# EAGLE schematic Control (EAGLE 7.5.0)
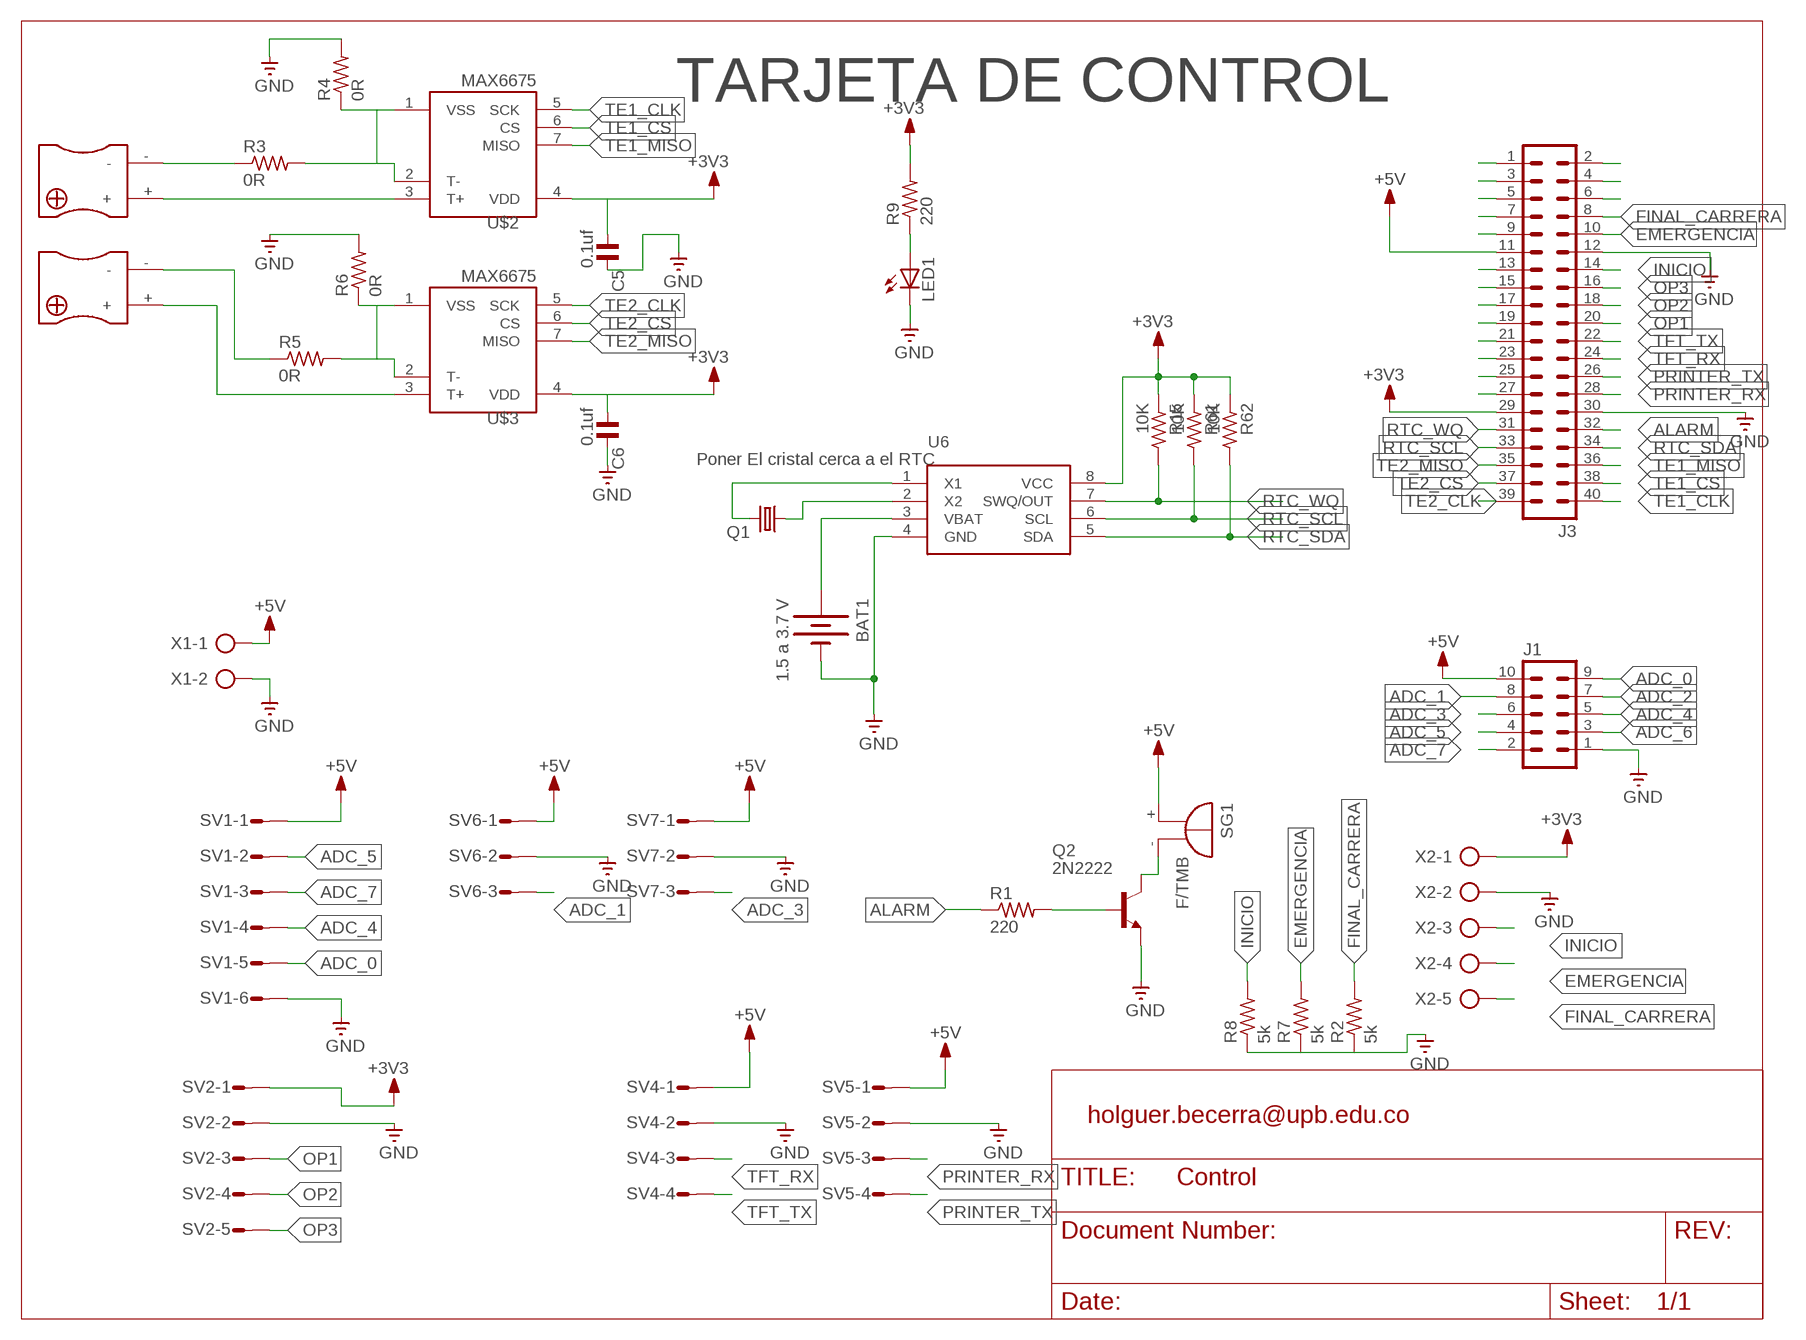
[diagram p0: schematic, sheet 1]

## Parts
BAT1  1.5 a 3.7 V  BATTERY20PTH  [BATTCOM_20MM_PTH]
C5  0.1uf  C2,5-3  [C2.5-3]
C6  0.1uf  C2,5-3  [C2.5-3]
J1  ML10  [ML10]
J3  ML40  [ML40]
LED1  LED  [SMARTLED-TTW]
Q1  CRYSTALTC26H  [TC26H]
Q2  2N2222  [TO18]
R1  220  R-US_0204/5  [0204/5]
R2  5k  R-US_0204/5  [0204/5]
R3  0R  R-US_0204/5  [0204/5]
R4  0R  R-US_0204/5  [0204/5]
R5  0R  R-US_0204/5  [0204/5]
R6  0R  R-US_0204/5  [0204/5]
R7  5k  R-US_0204/5  [0204/5]
R8  5k  R-US_0204/5  [0204/5]
R9  220  R-US_0204/5  [0204/5]
R15  10K  R-US_R0603  [R0603]
R61  10K  R-US_R0603  [R0603]
R62  10K  R-US_R0603  [R0603]
SG1  F/TMB  [F/TMB]
SV1  L06P  [L06P]
SV2  L05P  [L05P]
SV4  L04P  [L04P]
SV5  L04P  [L04P]
SV6  L03P  [L03P]
SV7  L03P  [L03P]
U6  DS1338  [SO08]
U$1  THERMOCOUPLEPLUG_MINI  [TC-MINI]
U$2  MAX6675  [SO08]
U$3  MAX6675  [SO08]
U$4  THERMOCOUPLEPLUG_MINI  [TC-MINI]
X1  AK500/2  [AK500/2]
X2  AK500/5-H  [AK500/5-H]

## Nets
5VCC: J1.10 J3.11 SG1.+ SV1.1 SV4.1 SV5.1 SV6.1 SV7.1 X1.1 ; supply symbol labelled +5V
+3V3: C5.1 C6.1 J3.29 R9.2 R15.1 R61.1 R62.1 SV2.1 U6.8(VCC) U$2.4(VDD) U$3.4(VDD) X2.1
ADC_0: J1.9 SV1.5
ADC_1: J1.8 SV6.3
ADC_2: J1.7
ADC_3: J1.6 SV7.3
ADC_4: J1.5 SV1.4
ADC_5: J1.4 SV1.2
ADC_6: J1.3
ADC_7: J1.2 SV1.3
ALARM: J3.32 R1.1
EMERGENCIA: J3.10 R7.2 X2.4
FINAL_CARRERA: J3.8 R2.2 X2.5
GND: BAT1.2(-) C5.2 C6.2 J1.1 J3.12 J3.30 LED1.C@1(C) Q2.1(E) R2.1 R4.2 R6.2 R7.1 R8.1 SV1.6 SV2.2 SV4.2 SV5.2 SV6.2 SV7.2 U6.4(GND) X1.2 X2.2
INICIO: J3.14 R8.2 X2.3
N$1: Q1.2 U6.1(X1)
N$2: LED1.A@1(A) R9.1
N$3: J3.9
N$4: Q2.3(C) SG1.-
N$5: Q2.2(B) R1.2
N$6: U$1.+ U$2.3(T+)
N$7: R5.1 U$4.-
N$8: U$3.3(T+) U$4.+
N$9: Q1.1 U6.2(X2)
N$11: R3.1 U$1.-
N$30: R5.2 R6.1 U$3.1(VSS) U$3.2(T-)
N$31: R3.2 R4.1 U$2.1(VSS) U$2.2(T-)
N$33: J3.2
N$34: J3.4
N$35: BAT1.1(+) U6.3(VBAT)
N$36: J3.6
N$60: J3.27
N$61: J3.25
N$62: J3.23
N$63: J3.21
N$64: J3.19
N$65: J3.17
N$66: J3.15
N$67: J3.13
N$70: J3.7
N$71: J3.5
N$72: J3.3
N$73: J3.1
OP1: J3.20 SV2.3
OP2: J3.18 SV2.4
OP3: J3.16 SV2.5
PRINTER_RX: J3.28 SV5.3
PRINTER_TX: J3.26 SV5.4
RTC_SCL: J3.33 R61.2 U6.6(SCL)
RTC_SDA: J3.34 R62.2 U6.5(SDA)
RTC_WQ: J3.31 R15.2 U6.7(SWQ/OUT)
TE1_CLK: J3.40 U$2.5(SCK)
TE1_CS: J3.38 U$2.6(CS)
TE1_MISO: J3.36 U$2.7(MISO)
TE2_CLK: J3.39 U$3.5(SCK)
TE2_CS: J3.37 U$3.6(CS)
TE2_MISO: J3.35 U$3.7(MISO)
TFT_RX: J3.24 SV4.3
TFT_TX: J3.22 SV4.4

## Notes on the sheet
- TARJETA DE CONTROL
- Poner El cristal cerca a el RTC
- holguer.becerra@upb.edu.co

## Library data of the parts
BAT1 = SparkFun:BATTERY: Battery Holders Various common sizes : AA, AAA, 20mm coin cell and 12mm coin cell.
C5 C6 = capacitor-wima:C: CAPACITOR naming: grid - package width
J1 = con-harting-ml:ML10: HARTING
J3 = con-harting-ml:ML40: HARTING
LED1 = adafruit:LED: LED OSRAM: - CHIPLED LG R971, LG N971, LY N971, LG Q971, LY Q971, LO R971, LY R971 LH N974, LH R974 LS Q976, LO Q976, LY Q976 LO Q996 - Hyper CHIPLED LW Q18S LB Q993, LB Q99A, LB R99A - SideLED LS A670, LO A670, LY A670, LG A670, LP A670 LB A673, LV A673, LT A673, LW A673 LH A674 LY A675 LS A676, LA A676, LO A676, LY A676, LW A676 LS A679, LY A679, LG A679 - Hyper Micro SIDELED® LS Y876, LA Y876, LO Y876, LY Y876 LT Y87S - SmartLED LW L88C, LW L88S LB L89C, LB L89S, LG L890 LS L89K, LO L89K, LY L89K LS L896, LA L896, LO L896, LY L896 - TOPLED LS T670, LO T670, LY T670, LG T670, LP T670 LSG T670, LSP T670, LSY T670, LOP T670, LYG T670 LG T671, LOG T671, LSG T671 LB T673, LV T673, LT T673, LW T673 LH T674 LS T676, LA T676, LO T676, LY T676, LB T676, LH T676, LSB T676, LW T676 LB T67C, LV T67C, LT T67C, LS T67K, LO T67K, LY T67K, LW E67C LS E67B, LA E67B, LO E67B, LY E67B, LB E67C, LV E67C, LT E67C LW T67C LS T679, LY T679, LG T679 LS T770, LO T770, LY T770, LG T770, LP T770 LB T773, LV T773, LT T773, LW T773 LH T774 LS E675, LA E675, LY E675, LS T675 LS T776, LA T776, LO T776, LY T776, LB T776 LHGB T686 LT T68C, LB T68C - Hyper Mini TOPLED® LB M676 - Mini TOPLED Santana® LG M470 LS M47K, LO M47K, LY M47K Source: http://www.osram.convergy.de/
Q1 = crystal:CRYSTAL: CRYSTAL; OC_FARNELL: unknown; OC_NEWARK: unknown
Q2 = transistor:2N2222: NPN TRANSISTOR
R1-R9 = resistor:R-US_: RESISTOR, American symbol
R15 R61 R62 = rcl:R-US_: RESISTOR, American symbol
SG1 = buzzer:F/TMB: BUZZER Source: Buerklin
SV1 = con-amp-mt:L06P: AMP MT CONNECTOR
SV2 = con-amp-mt:L05P: AMP MT CONNECTOR
SV4 SV5 = con-amp-mt:L04P: AMP MT CONNECTOR
SV6 SV7 = con-amp-mt:L03P: AMP MT CONNECTOR
U6 = STERICLINIC:DS1338
U$1 U$4 = max6675:THERMOCOUPLEPLUG_MINI
U$2 U$3 = max6675:MAX6675
X1 = con-ptr500:AK500/2: CONNECTOR
X2 = con-ptr500:AK500/5-H: CONNECTOR Aug. 2004 / PTR Meßtechnik: Die Bezeichnung der Serie AK505 wurde geändert. Es handelt sich hierbei um AK500 in horizontaler Ausführung.